# Altium schematic sheet Receiver.SchDoc
size A4; CompanyName: Technische Hochschule Nürnberg Georg Simon Ohm; Organization: UltraZohm; Address1: Kesslerplatz 12; Address2: 90489 Nürnberg; Address3: GERMANY; SheetNumber: 3; SheetTotal: 7; Website: www.ultrazohm.com
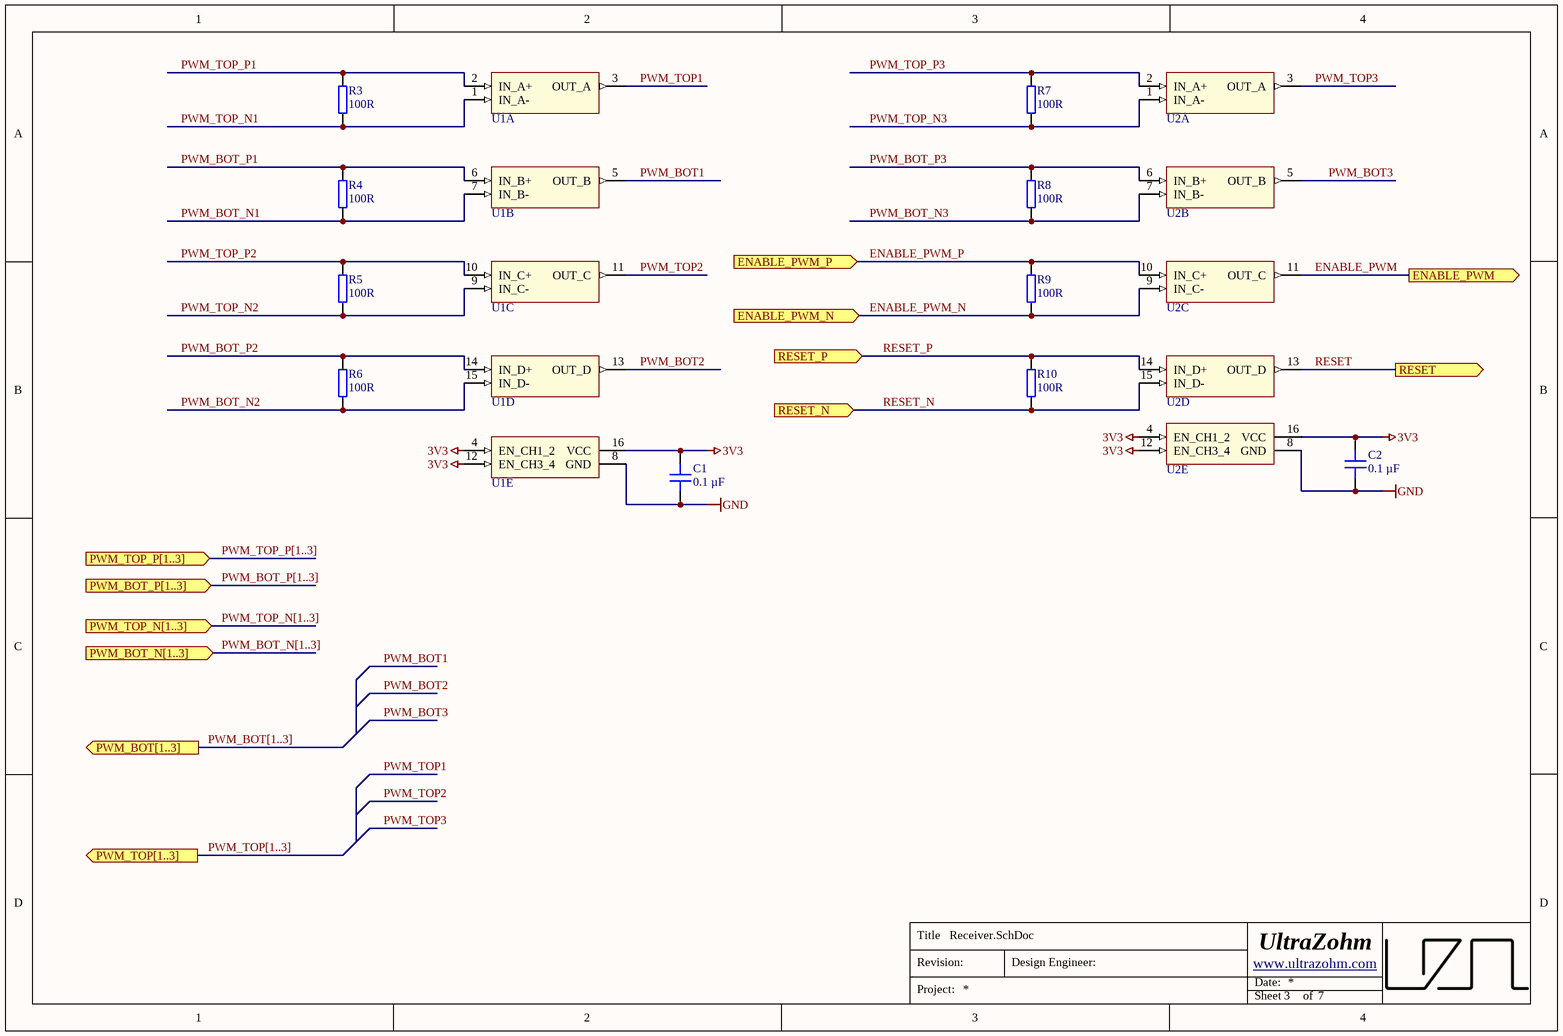
[diagram p0: Receiver.SchDoc]

## Parts
C1  0.1 µF  [C_0603]
C2  0.1 µF  [C_0603]
R3  100R  [RES 0603_1608]
R4  100R  [RES 0603_1608]
R5  100R  [RES 0603_1608]
R6  100R  [RES 0603_1608]
R7  100R  [RES 0603_1608]
R8  100R  [RES 0603_1608]
R9  100R  [RES 0603_1608]
R10  100R  [RES 0603_1608]
U1  DS34LV86TM/NOPB  [TI_D-R-PDSO-G16_N]  (value not drawn)  (parts A,B,C,D,E of 5)
U2  DS34LV86TM/NOPB  [TI_D-R-PDSO-G16_N]  (value not drawn)  (parts A,B,C,D,E of 5)

## Ports
ENABLE_PWM (out), ENABLE_PWM_N (in), ENABLE_PWM_P (in), PWM_BOT[1..3] (out), PWM_BOT_N[1..3] (in), PWM_BOT_P[1..3] (in), PWM_TOP[1..3] (out), PWM_TOP_N[1..3] (in), PWM_TOP_P[1..3] (in), RESET (out), RESET_N (in), RESET_P (in)

## Nets
3V3: C1.2 C2.2 U1.4(EN_CH1_2) U1.12(EN_CH3_4) U1.16(VCC) U2.4(EN_CH1_2) U2.12(EN_CH3_4) U2.16(VCC)
GND: C1.1 C2.1 U1.8(GND) U2.8(GND)
ENABLE_PWM: U2.11(OUT_C) ; port ENABLE_PWM
ENABLE_PWM_N: R9.1 U2.9(IN_C-) ; port ENABLE_PWM_N
ENABLE_PWM_P: R9.2 U2.10(IN_C+) ; port ENABLE_PWM_P
PWM_BOT1: U1.5(OUT_B)
PWM_BOT2: U1.13(OUT_D)
PWM_BOT3: U2.5(OUT_B)
PWM_BOT_N1: R4.1 U1.7(IN_B-)
PWM_BOT_N2: R6.1 U1.15(IN_D-)
PWM_BOT_N3: R8.1 U2.7(IN_B-)
PWM_BOT_P1: R4.2 U1.6(IN_B+)
PWM_BOT_P2: R6.2 U1.14(IN_D+)
PWM_BOT_P3: R8.2 U2.6(IN_B+)
PWM_TOP1: U1.3(OUT_A)
PWM_TOP2: U1.11(OUT_C)
PWM_TOP3: U2.3(OUT_A)
PWM_TOP_N1: R3.1 U1.1(IN_A-)
PWM_TOP_N2: R5.1 U1.9(IN_C-)
PWM_TOP_N3: R7.1 U2.1(IN_A-)
PWM_TOP_P1: R3.2 U1.2(IN_A+)
PWM_TOP_P2: R5.2 U1.10(IN_C+)
PWM_TOP_P3: R7.2 U2.2(IN_A+)
RESET: U2.13(OUT_D) ; port RESET
RESET_N: R10.1 U2.15(IN_D-) ; port RESET_N
RESET_P: R10.2 U2.14(IN_D+) ; port RESET_P

## Buses and harness runs
bus PWM_BOT[1..3] = port PWM_BOT[1..3]
bus PWM_BOT_N[1..3] = port PWM_BOT_N[1..3]
bus PWM_BOT_P[1..3] = port PWM_BOT_P[1..3]
bus PWM_TOP[1..3] = port PWM_TOP[1..3]
bus PWM_TOP_N[1..3] = port PWM_TOP_N[1..3]
bus PWM_TOP_P[1..3] = port PWM_TOP_P[1..3]

## Notes on the sheet
- Title
- Revision:
- Design Engineer:
- Date:
- Project:
- Sheet
- of

## Library data of the parts
C1 C2 = C0603X104K5RAC7411: Capacitor 0603, 50 VDC, 0.1 µF, X7R; Manufacturer: KEMET; Tolerance: 10 %; Voltage Rating: 50 VDC; Created from: MGremer; Manufacturer Part Number: C0603X104K5RAC7411; PartID: 3; Created On: 20.12.2020 13:54:13; ComponentLink1Description: Datasheet; ComponentLink1URL: https://www.mouser.de/datasheet/2/212/1/KEM_C1013_X7R_FT_CAP_SMD-1103280.pdf; Component Type: Capacitor 0603; Device Package: 0603; Last Updated: 04.03.2021 09:24:28; Mounting Type: SMD; Operating Temperature: -55 - 125°C; Series: SMD Comm X7R Flex; Supplier 1: Mouser; Supplier Part Number 1: 80-C0603X104K5R7411; Supplier 2: LCSC; Supplier Part Number 2: C14663; Type: Capacitor; Value: 0.1 µF; Live Cycle Status: 1; LCSC Part Number: C14663; Stock number: Labor SMD Container
R3-R10 = RK73B1JTTD101J: SMD resistor E24 series; Manufacturer: KOA Speer; Tolerance: 5%; Created from: MGremer; Manufacturer Part Number: RK73B1JTTD101J; PartID: 50; Created On: 14.12.2020 16:17:14; ComponentLink1Description: Datasheet; ComponentLink1URL: https://www.mouser.de/datasheet/2/219/RK73B-1825463.pdf; Component Type: SMD resistor; Device Package: 0603; Last Updated: 29.11.2022 14:30:07; Mounting Type: SMD; Supplier 1: Mouser; Supplier Part Number 1: 660-RK73B1JTTD101J; Supplier 2: LCSC; Supplier Part Number 2: C22775; Type: Resistor; Value: 100R; Live Cycle Status: 1; Stock number: Labor SMD Container; LCSC Part Number: C22775
U1 U2 = DS34LV86TM/NOPB: 3V Enhanced CMOS Quad Differential Line Receiver, 16-pin Narrow SOIC, Pb-Free; Manufacturer: Texas Instruments; Created from: D. Hufnagel; Manufacturer Part Number: DS34LV86TM/NOPB; PartID: 9; Created On: 01.03.2021 10:35:45; ComponentLink1Description: Datasheet; ComponentLink1URL: https://www.ti.com/lit/gpn/ds34lv86t; Component Type: RS422 Receiver; Device Package: SOIC; Last Updated: 04.03.2021 09:04:43; Minimum Order: 1; Mounting Type: SMD; Operating Temperature: -40°C - 85°C; Series: DS34LV86T; Supplier 1: Mouser; Supplier Part Number 1: 926-DS26LV32ATM/NOPB; Supplier 2: Mouser; Supplier Part Number 2: 926-DS34LV86TM/NOPB; Supplier 3: LCSC; Supplier Part Number 3: C181570; Type: Standard; Live Cycle Status: 1; Stock number: not stored; LCSC Part Number: C181570